# EAGLE design Shruthi-Analog-v02 (EAGLE 5.07)
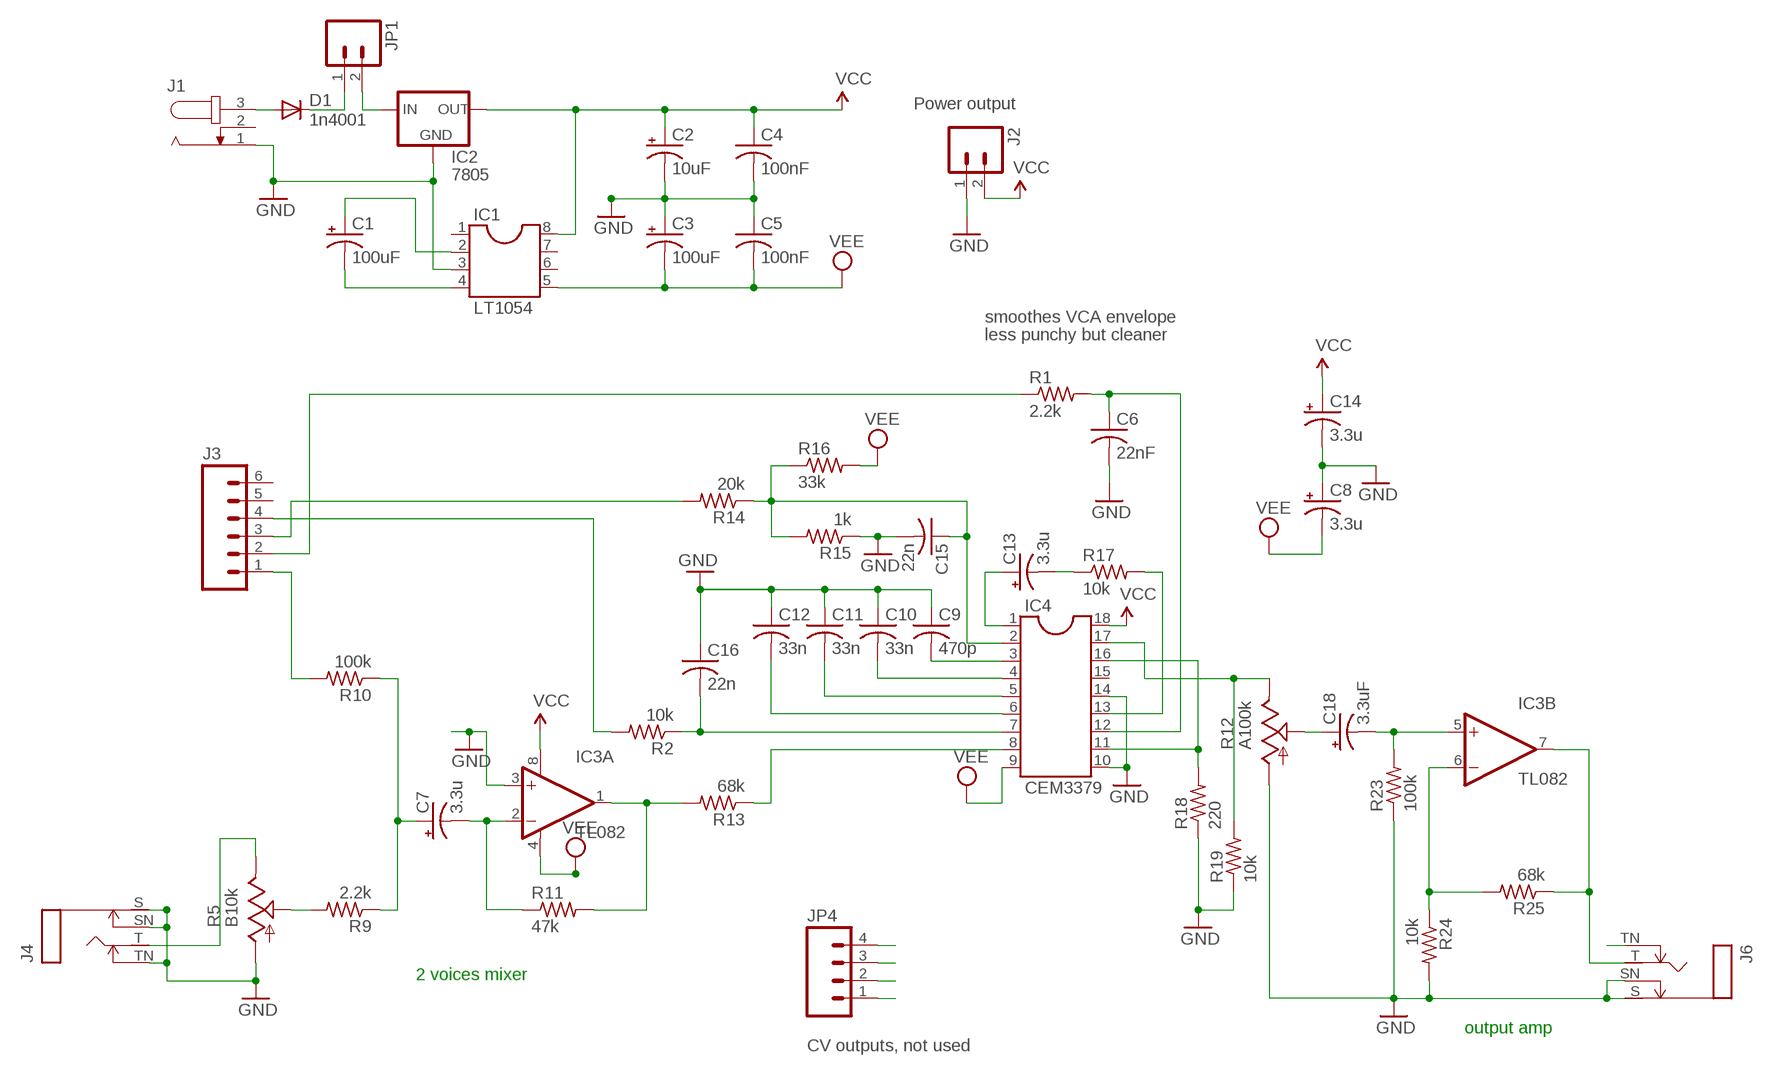
[diagram p0: schematic, sheet 1]

## Parts
C1  100uF  CPOL-USE2.5-7  [E2,5-7]
C2  10uF  CPOL-USE2.5-7  [E2,5-7]
C3  100uF  CPOL-USE2.5-7  [E2,5-7]
C4  100nF  C-US025-024X044  [C025-024X044]
C5  100nF  C-US025-024X044  [C025-024X044]
C6  22nF  C-US050-025X075  [C050-025X075]
C7  3.3u  CPOL-USE2.5-6  [E2,5-6]
C8  3.3u  CPOL-USE2.5-6  [E2,5-6]
C9  470p  C-US050-024X044  [C050-024X044]
C10  33n  C-US050-025X075  [C050-025X075]
C11  33n  C-US050-025X075  [C050-025X075]
C12  33n  C-US050-025X075  [C050-025X075]
C13  3.3u  CPOL-USE2.5-6  [E2,5-6]
C14  3.3u  CPOL-USE2.5-6  [E2,5-6]
C15  22n  C-US050-025X075  [C050-025X075]
C16  22n  C-US050-025X075  [C050-025X075]
C18  3.3uF  CPOL-USE2.5-5  [E2,5-5]
D1  1n4001  DIODEPTH  [DIODE-1N4001]
IC1  LT1054  DIL8  [DIL08]
IC2  7805  V_REG_78XXSIDE  [78XXL]
IC3  TL082  OPA2132P  [DIL08]
IC4  CEM3379  CEM3379SOCKET  [SOCKET18]
J1  JACK-PLUG  [SPC4078_LARGER_HOLES]
J2  M02PTH  [1X02]
J3  M06SIP  [1X06]
J4  MONOSWS  [NMJ4HC-S]
J6  MONOSWS  [NMJ4HC-S]
JP1  M02  [1X02_LONGPADS]
JP4  M04PTH  [1X04]
R1  2.2k  R-US_0204/7  [0204/7]
R2  10k  R-US_0204/7  [0204/7]
R5  B10k  POT_USCABLED  [CABLE_POT_6MM]
R9  2.2k  R-US_0204/7  [0204/7]
R10  100k  R-US_0204/7  [0204/7]
R11  47k  R-US_0204/7  [0204/7]
R12  A100k  POT_USCABLED  [CABLE_POT_6MM]
R13  68k  R-US_0204/7  [0204/7]
R14  20k  R-US_0204/7  [0204/7]
R15  1k  R-US_0204/7  [0204/7]
R16  33k  R-US_0204/7  [0204/7]
R17  10k  R-US_0204/7  [0204/7]
R18  220  R-US_0204/7  [0204/7]
R19  10k  R-US_0204/7  [0204/7]
R23  100k  R-US_0204/7  [0204/7]
R24  10k  R-US_0204/7  [0204/7]
R25  68k  R-US_0204/7  [0204/7]

## Nets
AUDIOIN: IC3.1(A:OUT) R11.2 R13.2
GND: C2.- C3.+ C4.2 C5.1 C6.2 C8.+ C9.1 C10.1 C11.1 C12.1 C14.- C15.2 C16.1 IC1.3 IC2.GND IC3.3(A:+IN) IC4.10(GND) IC4.14(PANCV) J1.1 J2.1 J4.S J4.SN J4.TN J6.S J6.SN R5.A R12.A R15.1 R18.1 R19.1 R23.1 R24.2
N$1: C1.+ IC1.2
N$2: D1.A J1.3
N$3: D1.C JP1.1
N$4: IC2.IN JP1.2
N$5: C1.- IC1.4
N$6: IC4.8(VCFIN) R13.1
N$7: R5.S R9.2
N$8: J3.1 R10.2
N$9: J3.3 R14.2
N$10: JP4.4
N$11: JP4.3
N$12: JP4.2
N$13: JP4.1
N$14: C6.1 IC4.12(GAINCV) R1.2
N$17: J6.TN
N$18: J3.2 R1.1
N$19: J3.4 R2.2
N$21: C7.- IC3.2(A:-IN) R11.1
N$23: C7.+ R9.1 R10.1
N$25: C18.- IC3.5(B:+IN) R23.2
N$26: C9.2 IC4.3(CD)
N$27: C10.2 IC4.4(CC)
N$29: C11.2 IC4.5(CB)
N$30: IC4.17(CHB) R12.E R19.2
N$31: C12.2 IC4.6(CA)
N$33: C16.2 IC4.7(RESONANCECV) R2.1
N$35: IC4.13(VCAIN) R17.2
N$36: C13.- R17.1
N$37: IC3.7(B:OUT) J6.T R25.1
N$38: IC4.11(VCAOUT) IC4.16(PANIN) R18.2
N$39: C13.+ IC4.1(VCFOUT)
N$41: J4.T R5.E
N$43: C15.1 IC4.2(FREQUENCYCV) R14.1 R15.2 R16.1
N$44: C18.+ R12.S
N$45: IC3.6(B:-IN) R24.1 R25.2
VCC: C2.+ C4.1 C14.+ IC1.8 IC2.OUT IC3.8(A:V+) IC4.18(VCC) J2.2
VEE: C3.- C5.2 C8.- IC1.5 IC3.4(A:V-) IC4.9(VEE) R16.2
Unconnected: IC1.1 IC1.6 IC1.7 IC4.15(CHAOUT) J1.2 J3.5 J3.6

## Notes on the sheet
- Power output
- smoothes VCA envelope
- less punchy but cleaner
- 2 voices mixer
- output amp
- CV outputs, not used

## Library data of the parts
C1-C3 C7 C8 C13 C14 C18 = rcl:CPOL-US: POLARIZED CAPACITOR, American symbol
C4-C6 C9-C12 C15 C16 = rcl:C-US: CAPACITOR, American symbol
D1 = SparkFun:DIODE: Diode These are standard reverse protection diodes and small signal diodes. SMA package can handle up to about 1A. SOD-323 can handle about 200mA. What the SOD-323 package when ordering, there are some mfgs out there that are 5-pin packages.
IC1 = ic-package:DIL8: Dual In Line / Socket
IC2 = SparkFun:V_REG_78XX: Voltage Regulator Standard 7805 5V regulator. IGO (Input Ground Output). Spark Fun Electronics SKU : COM-00107
IC3 = burr-brown:OPA2132: High Speed FET-Input Operational Amplifiers< Product Folder:OPA2132
IC4 = cem:CEM3379: Voltage Controlled Signal Processor VCF+VCA+panner
J1 = con-jack:JACK-PLUG: DC POWER JACK Power Jack, DC, Right Angle, Through Hole, Rated 5A at 16VDC, PC Terminals Distributor: Farnell (www.Farnell.de) Drawing: 84N1161.pdf / 84N1162.pdf Manufacturer: SPC Technology (www.spctechnology.com) Type: SPC4077 / SPC 4078
J2 JP1 = SparkFun:M02: Header 2 Standard 2-pin 0.1" header. Use with straight break away headers (SKU : PRT-00116), right angle break away headers (PRT-00553), swiss pins (PRT-00743), machine pins (PRT-00117), and female headers (PRT-00115). Molex polarized connector foot print use with SKU : PRT-08233 with associated crimp pins and housings.
J3 = SparkFun:M06: Header 6 Standard 6-pin 0.1" header. Use with straight break away headers (SKU : PRT-00116), right angle break away headers (PRT-00553), swiss pins (PRT-00743), machine pins (PRT-00117), and female headers (PRT-00115). Molex polarized connector foot print use with SKU : PRT-08094 with associated crimp pins and housings. NOTES ON THE VARIANTS LOCK and LOCK_LONGPADS... This footprint was designed to help hold the alignment of a through-hole component (i.e. 6-pin header) while soldering it into place. You may notice that each hole has been shifted either up or down by 0.005 of an inch from it's more standard position (which is a perfectly straight line). This slight alteration caused the pins (the squares in the middle) to touch the edges of the holes. Because they are alternating, it causes a "brace" to hold the component in place. 0.005 has proven to be the perfect amount of "off-center" position when using our standard breakaway headers. Although looks a little odd when you look at the bare footprint, once you have a header in there, the alteration is very hard to notice. Also, if you push a header all the way into place, it is covered up entirely on the bottom side. This idea of altering the position of holes to aid alignment will be further integrated into the Sparkfun Library for other footprints. It can help hold any component with 3 or more connection pins.
J4 J6 = gm-jacks:MONOSW
JP4 = SparkFun:M04: Header 4 Standard 4-pin 0.1" header. Use with straight break away headers (SKU : PRT-00116), right angle break away headers (PRT-00553), swiss pins (PRT-00743), machine pins (PRT-00117), and female headers (PRT-00115). Molex polarized connector foot print use with SKU : PRT-08231 with associated crimp pins and housings.
R1 R2 R9-R11 R13-R19 R23-R25 = resistor:R-US_: RESISTOR, American symbol
R5 R12 = pot-cable:POT_US

## Board
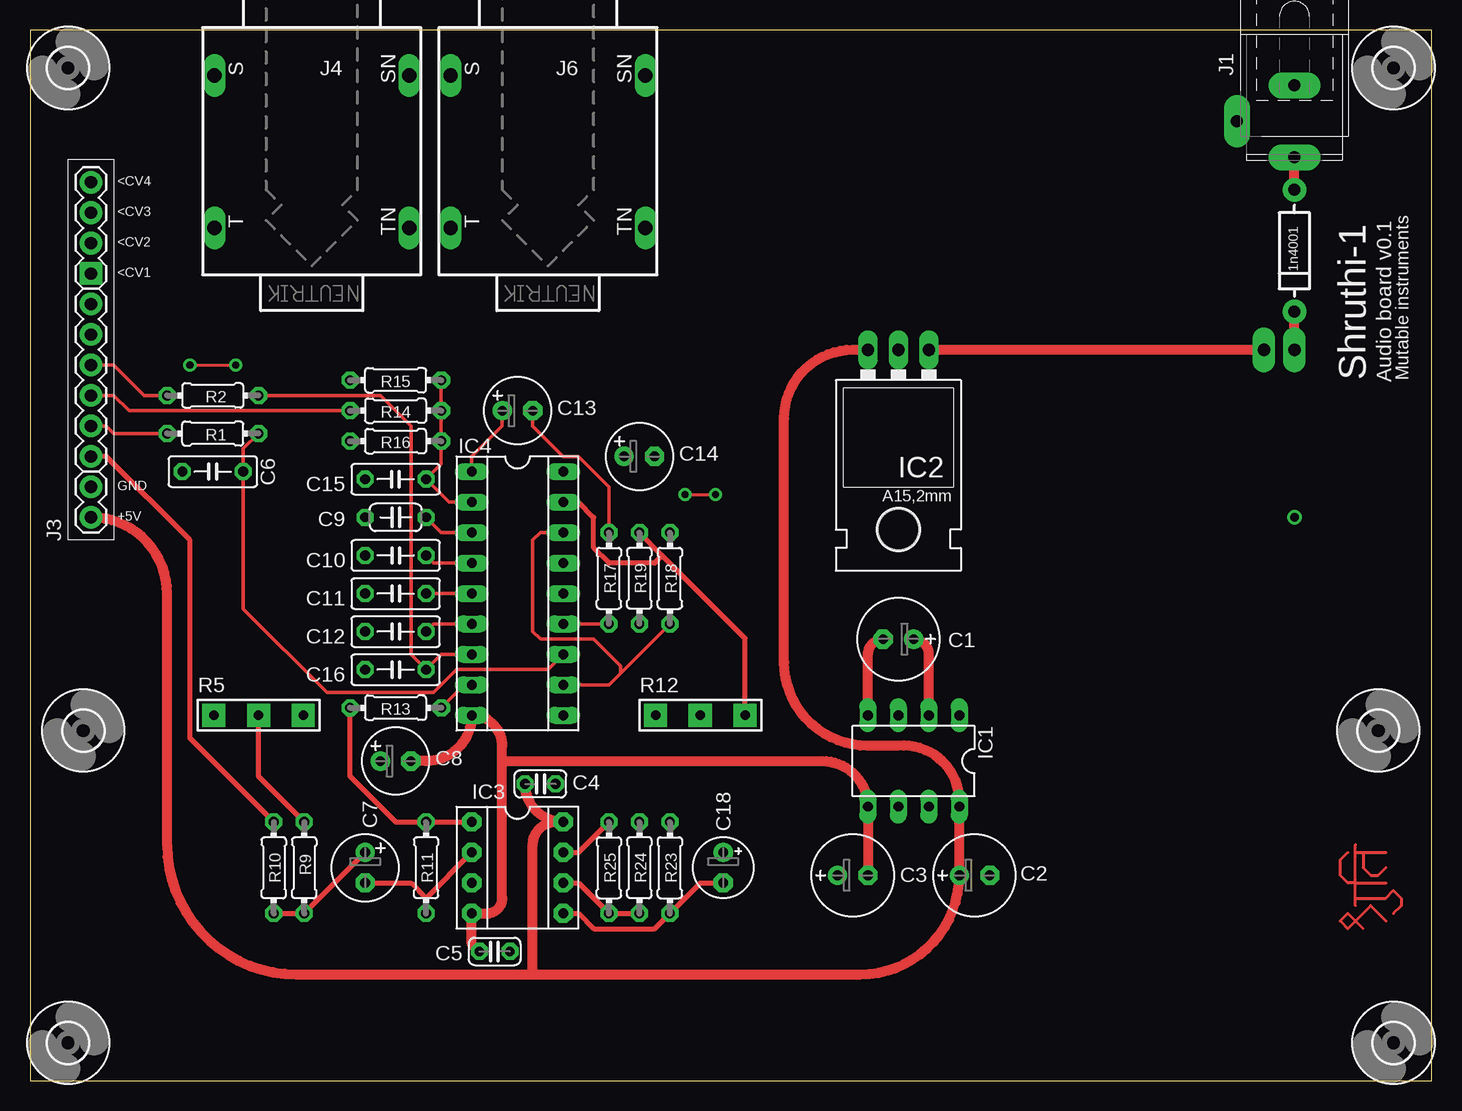
[diagram p1: board, top side]
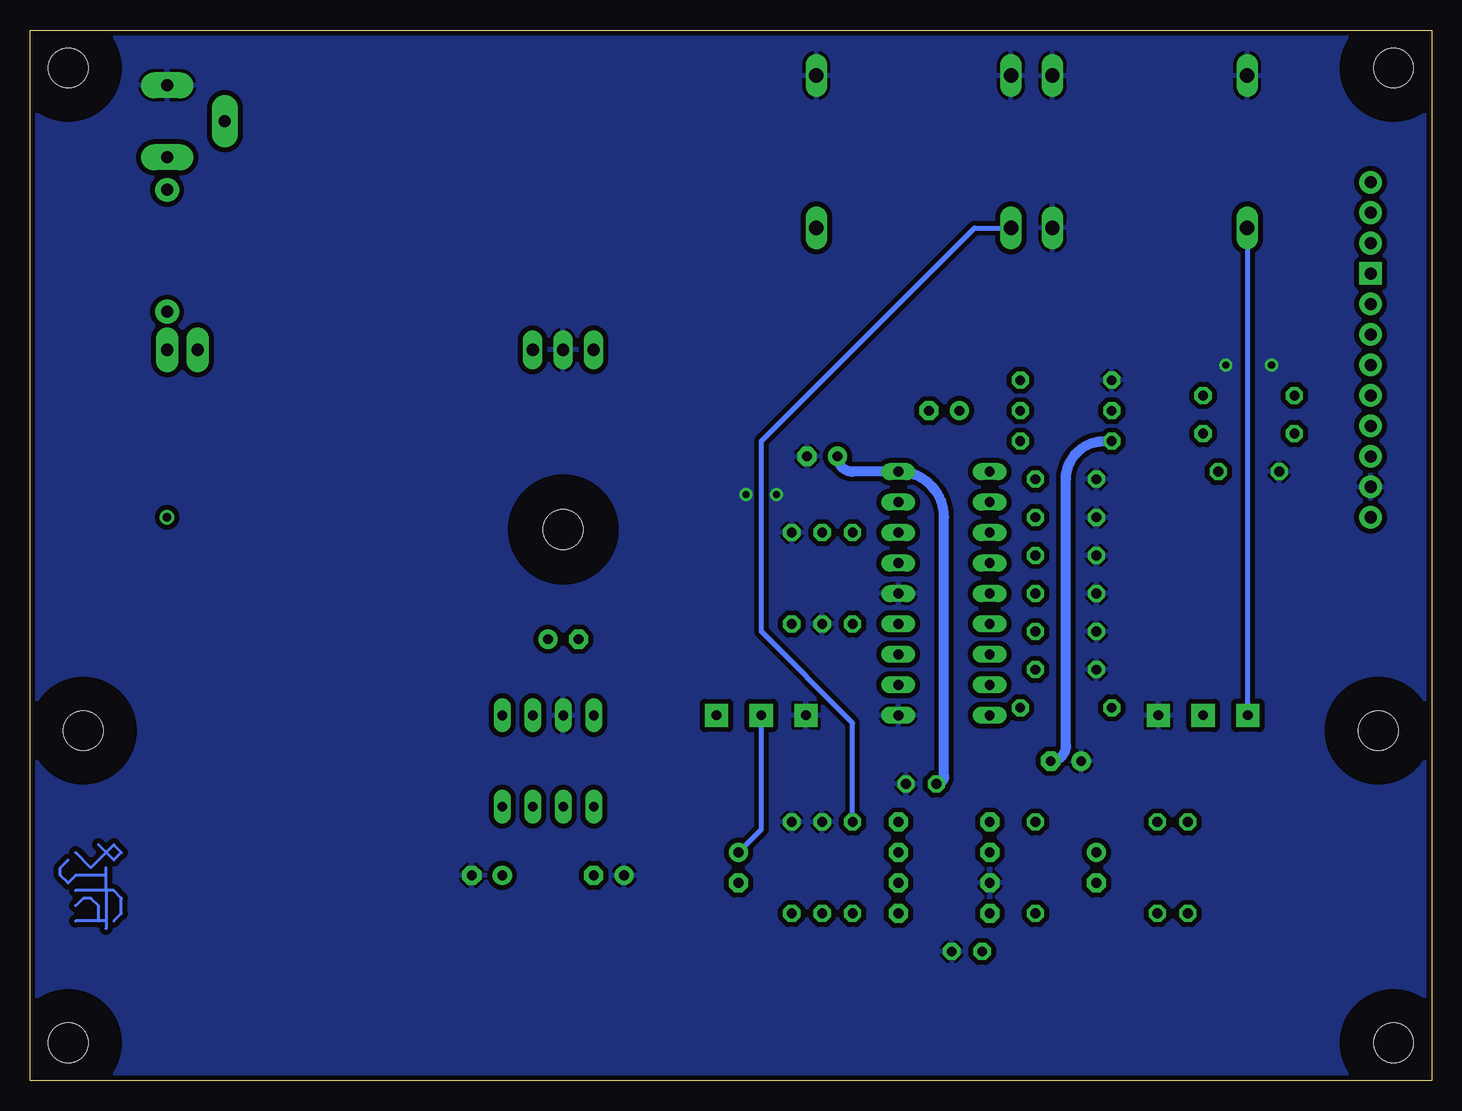
[diagram p2: board, bottom side, seen from below]

Size 116.84 x 87.62 mm. Coordinates in mm from the lower left corner, seen from the top.
Outline: 0,0 116.84,0 116.84,87.62 0,87.62 0,0
Copper layers (1*16): Top 0.035mm / dielectric 1.5mm / Bottom 0.035mm
Design rules "SparkFun_10mil": minimum track width 10mil, minimum drill 20mil, track to track 10mil, track to pad 10mil, pad to pad 10mil, via to via 10mil, smd to smd 10mil, copper to edge 10mil, drill to drill 10mil, minimum pad ring 12mil, minimum via ring 10mil, stop-mask expansion 4mil, vias tented up to drill 25mil, thermal gap 10mil

### Footprints (pad centres in the part's own frame; a part is rotated, then mirrored left to right if it is on the bottom)
E2,5-7 = drill 0.813 pad 1.6 round: + -1.27,0 | drill 0.813 pad 1.6 octagon: - 1.27,0
C025-024X044 = drill 0.813 octagon: 1 -1.27,0; 2 1.27,0
C050-025X075 = drill 0.813 octagon: 1 -2.54,0; 2 2.54,0
E2,5-6 = drill 0.813 pad 1.6 round: + -1.27,0 | drill 0.813 pad 1.6 octagon: - 1.27,0
C050-024X044 = drill 0.813 octagon: 1 -2.54,0; 2 2.54,0
E2,5-5 = drill 0.813 pad 1.6 round: + -1.27,0 | drill 0.813 pad 1.6 octagon: - 1.27,0
DIODE-1N4001 = drill 1 pad 1.981 round: A -5.08,0; C 5.08,0
DIL08 = drill 0.813 long: 1 -3.81,-3.81; 2 -1.27,-3.81; 3 1.27,-3.81; 4 3.81,-3.81; 5 3.81,3.81; 6 1.27,3.81; 7 -1.27,3.81; 8 -3.81,3.81
78XXL = drill 1.016 long: GND 0,-3.81; IN -2.54,-3.81; OUT 2.54,-3.81 | hole 3.302: 0,11.176
DIL08' = drill 0.813 pad 1.6 octagon: 1 -3.81,-3.81; 2 -1.27,-3.81; 3 1.27,-3.81; 4 3.81,-3.81; 5 3.81,3.81; 6 1.27,3.81; 7 -1.27,3.81; 8 -3.81,3.81
SOCKET18 = drill 0.813 long: 1 -10.16,-3.81; 2 -7.62,-3.81; 3 -5.08,-3.81; 4 -2.54,-3.81; 5 0,-3.81; 6 2.54,-3.81; 7 5.08,-3.81; 8 7.62,-3.81; 9 10.16,-3.81; 10 10.16,3.81; 11 7.62,3.81; 12 5.08,3.81; 13 2.54,3.81; 14 0,3.81; 15 -2.54,3.81; 16 -5.08,3.81; 17 -7.62,3.81; 18 -10.16,3.81
SPC4078_LARGER_HOLES = drill 1 pad 2.184 long: 1 -3,0; 2 0,-4.8; 3 3,0
1X02 = drill 1.016 pad 1.88 round: 1 0,0; 2 2.54,0
1X06 = drill 1.016 pad 1.88 round: 1 0,0; 2 2.54,0; 3 5.08,0; 4 7.62,0; 5 10.16,0; 6 12.7,0
NMJ4HC-S = drill 1.2 long: S 5.08,8.115; SN 5.08,-8.115; T -7.62,8.115; TN -7.62,-8.115
1X02_LONGPADS = drill 1.016 pad 1.88 long: 1 0,0; 2 2.54,0
1X04 = drill 1.016 pad 1.88 square: 1 0,0 | drill 1.016 pad 1.88 round: 2 2.54,0; 3 5.08,0; 4 7.62,0
0204/7 = drill 0.813 octagon: 1 -3.81,0; 2 3.81,0
CABLE_POT_6MM = drill 0.8 pad 1.93 square: A -3.73,0; E 3.73,0; S 0,0
3,3 = hole 3.3: 0,0

### Placement (x,y rotation side)
C1  72.39,36.83 180 top
C2  78.74,17.14 0 top
C3  68.58,17.14 0 top
C4  42.55,24.77 0 top
C5  38.73,10.8 180 top
C6  15.24,50.8 180 top
C7  27.94,17.78 270 top
C8  30.48,26.67 0 top
C9  30.48,46.99 0 top
C10  30.48,43.81 0 top
C11  30.48,40.64 0 top
C12  30.48,37.46 0 top
C13  40.64,55.88 0 top
C14  50.8,52.07 0 top
C15  30.48,50.16 180 top
C16  30.48,34.29 0 top
C18  57.78,17.78 270 top
D1  105.41,69.22 270 top
IC1  73.66,26.67 180 top
IC2  72.39,57.15 180 top
IC3  TL082  [DIL08']  40.64,17.78 270 top
IC4  40.64,40.64 270 top
J1  105.41,80.01 270 top
J2  5.08,49.53 270 top
J3  5.08,52.07 90 top
J4  23.49,78.74 90 top
J6  43.18,78.74 90 top
JP1  105.41,60.96 180 top
JP4  5.08,67.31 90 top
R1  15.24,53.98 0 top
R2  15.24,57.15 180 top
R5  19.05,30.48 180 top
R9  22.86,17.78 90 top
R10  20.32,17.78 90 top
R11  33.02,17.78 90 top
R12  55.88,30.48 0 top
R13  30.48,31.11 180 top
R14  30.48,55.88 180 top
R15  30.48,58.42 0 top
R16  30.48,53.34 180 top
R17  48.26,41.91 270 top
R18  53.34,41.91 270 top
R19  50.8,41.91 90 top
R23  53.34,17.78 270 top
R24  50.8,17.78 90 top
R25  48.26,17.78 270 top
U$1  [3,3]  3.17,84.46 0 top
U$2  [3,3]  113.66,84.46 0 top
U$3  [3,3]  113.66,3.17 0 top
U$4  [3,3]  112.39,29.21 0 top
U$5  [3,3]  4.45,29.21 0 top
U$6  [3,3]  3.17,3.17 0 top

### Tracks (layer width: path | path; a pad name or v marks a point on that pad's centre or on a via)
AUDIOIN
  Top 0.406: IC3.1 R11.2 30.48,21.59 26.67,25.4 R13.2
GND  (via drill 0.6)
  Top 0.254: v13.34,59.69 v17.14,59.69 | v54.61,48.89 v57.15,48.89
  pour Bottom (isolate 0.406): 0.63,87 0.63,0.64 116.2,0.64 116.2,87
N$1
  Top 0.813: IC1.2 74.93,35.56 arc90 C1.+
N$2
  Top 0.813: D1.A J1.3
N$3
  Top 0.813: JP1.1 D1.C
N$4
  Top 0.813: IC2.IN JP1.2
N$5
  Top 0.813: IC1.4 69.85,35.56 arc-90 C1.-
N$6
  Top 0.305: R13.1 36.2,33.02 IC4.8
N$7
  Top 0.406: R5.S 19.05,25.4 R9.2
N$8
  Top 0.406: R10.2 13.34,28.57 13.34,45.09 6.35,52.07 J3.1
N$9
  Top 0.305: J3.3 6.99,57.15 8.25,55.88 R14.2
N$14
  Top 0.305: IC4.12 43.18,34.29 35.56,34.29 33.66,32.38 24.77,32.38 17.78,39.37 C6.1 17.78,52.7 R1.2
N$15
  Bottom 0.254: 113.03,19.05 111.76,17.78 109.86,19.68 109.22,19.05 109.86,18.41 111.12,19.68
N$16  (via drill 0.7 pad 1.02)
  other vias: 105.41,46.99
N$18
  Top 0.305: J3.2 6.35,54.61 6.99,53.98 R1.1
N$19
  Top 0.305: J3.4 6.99,59.69 9.53,57.15 R2.2
N$21
  Top 0.406: C7.- 31.75,16.51 33.02,15.24 | 33.02,15.24 R11.1 | 33.02,15.24 IC3.2
N$23
  Top 0.406: R10.1 R9.1 C7.+
N$25
  Top 0.406: IC3.5 45.72,13.97 46.99,12.7 52.07,12.7 R23.2 55.88,16.51 C18.-
N$26
  Top 0.305: C9.2 34.29,45.72 IC4.3
N$27
  Top 0.305: C10.2 33.66,43.18 IC4.4
N$29
  Top 0.305: C11.2 IC4.5
N$30
  Top 0.406: 52.7,43.81 59.61,36.91 R12.E | 52.7,43.81 R19.2 | IC4.17 45.72,48.26 46.99,46.99 46.99,44.45 48.26,43.18 52.07,43.18 52.7,43.81
N$31
  Top 0.305: C12.2 33.66,38.1 IC4.6
N$33
  Top 0.305: IC4.7 34.29,35.56 C16.2 31.75,35.56 31.75,54.61 29.21,57.15 R2.1
N$35
  Top 0.305: IC4.13 R17.2
N$36
  Top 0.305: C13.- 41.91,54.61 44.45,52.07 45.72,52.07 48.26,49.53 R17.1
N$37
  Top 0.406: R25.1 45.72,19.05 IC3.7
  Bottom 0.406: R25.1 48.26,29.84 55.88,37.46 55.88,53.34 38.1,71.12 J6.T
N$38
  Top 0.305: 49.21,33.97 48.26,33.02 IC4.11 | 49.21,33.97 R18.2 | IC4.16 42.55,45.72 41.91,45.09 41.91,37.46 42.55,36.83 46.99,36.83 49.21,34.61 49.21,33.97
N$39
  Top 0.305: IC4.1 36.83,52.07 39.37,54.61 C13.+
N$41
  Bottom 0.406: R5.E 15.32,71.12
  Bottom 0.508: 15.32,71.12 J4.T
N$43
  Top 0.305: R15.2 R14.1 R16.1 34.29,51.44 C15.1 34.92,48.26 IC4.2
N$44
  Bottom 0.406: R12.S 55.88,20.95 C18.+
N$45
  Top 0.406: IC3.6 45.72,16.51 R25.2 R24.1
N$52
  Bottom 0.254: 110.49,17.14 110.49,17.78 | 110.49,15.88 110.49,17.14 | 110.49,15.88 110.49,13.34 | 110.49,13.34 110.49,12.7 | 111.12,13.34 113.03,13.34 | 110.49,13.34 111.12,13.34 | 111.12,13.34 111.12,14.61 111.76,15.24 112.39,15.24 113.03,14.61 | 110.49,17.14 113.03,17.14 113.66,16.51 114.3,17.14 114.3,17.78 113.66,18.41 | 110.49,15.88 113.03,15.88 | 110.49,15.88 109.86,15.88 109.22,15.24 109.22,13.97 109.86,13.34
N$53
  Top 0.254: 113.03,13.34 111.76,14.61 109.86,12.7 109.22,13.34 109.86,13.97 111.12,12.7
N$54
  Top 0.254: 110.49,14.61 110.49,15.24 | 110.49,15.24 110.49,16.51 | 110.49,16.51 110.49,19.05 | 110.49,19.05 110.49,19.68 | 111.12,19.05 113.03,19.05 | 110.49,19.05 111.12,19.05 | 111.12,19.05 111.12,17.78 111.76,17.14 112.39,17.14 113.03,17.78 | 110.49,15.24 113.03,15.24 113.66,15.88 114.3,15.24 114.3,14.61 113.66,13.97 | 110.49,16.51 113.03,16.51 | 110.49,16.51 109.86,16.51 109.22,17.14 109.22,18.41 109.86,19.05
VCC
  Top 0.813: IC2.OUT 68.58,60.96 arc90 62.86,55.24 62.86,34.92 arc90 69.85,27.94 72.39,27.94 arc-100 IC1.8 C2.+ arc-90 69.22,8.89 41.91,8.89 | C4.1 arc90 IC3.8 43.81,21.59 arc90 41.91,19.68 41.91,8.89 | 41.91,8.89 22.23,8.89 arc-90 11.43,19.68 11.43,40.64 arc90 J2.2
  Bottom 0.813: C4.1 arc-90 40.64,25.4 40.64,46.99 arc-90 IC4.18 48.26,50.8 arc90 C14.+
VEE
  Top 0.813: C5.2 36.83,11.43 IC3.4 38.1,13.97 arc90 39.37,15.24 39.37,26.67 | C8.- 33.02,26.67 arc90 IC4.9 arc-90 39.37,27.94 39.37,26.67 | 39.37,26.67 66.04,26.67 arc-90 IC1.5 C3.-
  Bottom 0.813: C8.- arc-90 30.48,27.94 30.48,50.16 arc90 27.3,53.34 R16.2

### Text on the board
tPlace: <CV4 | <CV3 | <CV2 | <CV1 | Mutable instruments | GND | +5V
tNames: Shruthi-1 | Audio board v0.1